# Altium schematic sheet Jetson_Orin_Nano.SchDoc
size A3; SheetNumber: 1; SheetTotal: 16
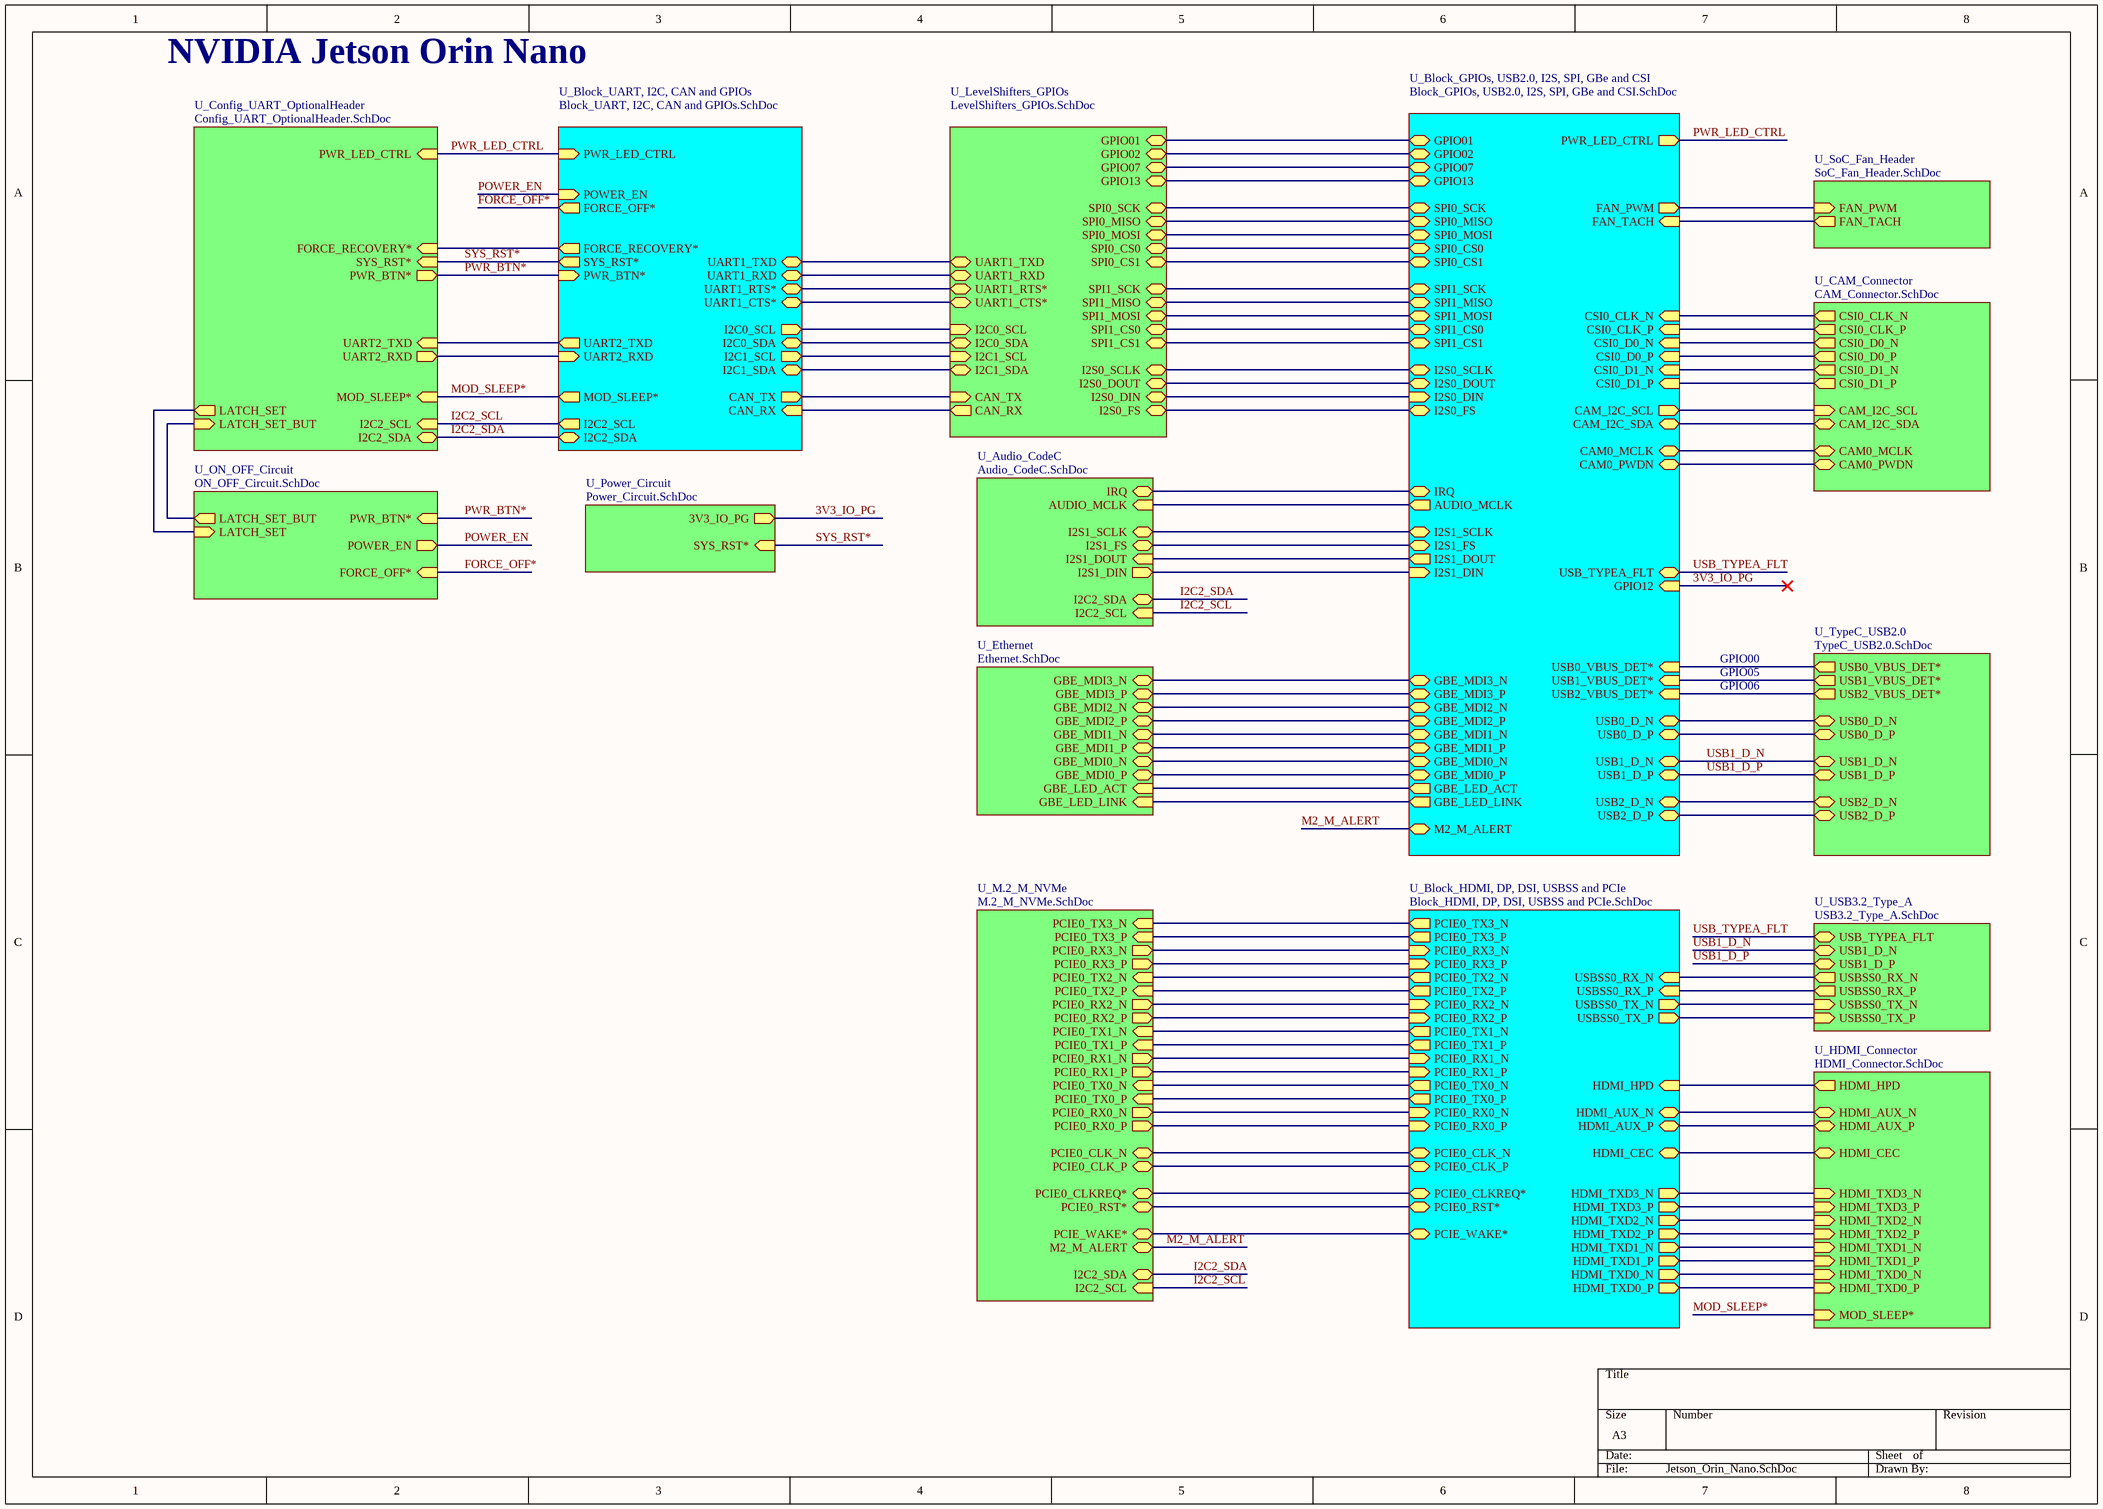
[diagram p0: Jetson_Orin_Nano.SchDoc]

## Sub-sheets
U_Audio_CodeC = Audio_CodeC.SchDoc: I2S1_SCLK (bidir), I2S1_DOUT (in), I2S1_FS (bidir), I2S1_DIN (out), AUDIO_MCLK (in), I2C2_SDA (bidir), I2C2_SCL (in), IRQ (bidir)
U_Block_GPIOs, USB2.0, I2S, SPI, GBe and CSI = Block_GPIOs, USB2.0, I2S, SPI, GBe and CSI.SchDoc: M2_M_ALERT (bidir), USB0_VBUS_DET* (in), I2S1_FS (bidir), I2S1_DOUT (out), I2S1_SCLK (bidir), I2S1_DIN (in), GBE_LED_LINK (out), GBE_LED_ACT (out), GBE_MDI3_N (bidir), GBE_MDI1_N (bidir), PWR_LED_CTRL (out), GPIO13 (bidir), AUDIO_MCLK (out), IRQ (bidir), SPI0_SCK (bidir), SPI0_MOSI (bidir), FAN_PWM (out), FAN_TACH (in), GPIO07 (bidir), SPI0_MISO (bidir), SPI1_SCK (bidir), SPI1_MOSI (bidir), SPI1_MISO (bidir), SPI1_CS0 (bidir), SPI1_CS1 (bidir), SPI0_CS0 (bidir), SPI0_CS1 (bidir), I2S0_FS (bidir), I2S0_SCLK (bidir), I2S0_DIN (in), I2S0_DOUT (bidir), GPIO02 (bidir), GPIO01 (bidir), CSI0_D0_P (in), CSI0_D0_N (in), CSI0_D1_P (in), CSI0_D1_N (in), CSI0_CLK_P (in), CSI0_CLK_N (in), CAM_I2C_SDA (bidir), CAM_I2C_SCL (out), CAM0_PWDN (bidir), CAM0_MCLK (bidir), USB_TYPEA_FLT (bidir), USB1_VBUS_DET* (in), USB2_VBUS_DET* (in), GPIO12 (in), GBE_MDI0_P (bidir), GBE_MDI0_N (bidir), GBE_MDI1_P (bidir), GBE_MDI2_P (bidir), GBE_MDI2_N (bidir), GBE_MDI3_P (bidir), USB2_D_N (bidir), USB1_D_P (bidir), USB0_D_N (bidir), USB0_D_P (bidir), USB2_D_P (bidir), USB1_D_N (bidir)
U_Block_HDMI, DP, DSI, USBSS and PCIe = Block_HDMI, DP, DSI, USBSS and PCIe.SchDoc: PCIE0_TX3_N (out), PCIE0_TX3_P (out), PCIE0_TX2_N (out), PCIE0_TX2_P (out), USBSS0_RX_N (in), USBSS0_TX_P (out), USBSS0_TX_N (out), USBSS0_RX_P (in), PCIE0_RX0_P (in), PCIE0_TX0_N (out), PCIE0_CLKREQ* (bidir), PCIE0_RST* (bidir), PCIE0_CLK_P (bidir), PCIE0_RX0_N (in), PCIE0_TX0_P (out), PCIE0_CLK_N (bidir), PCIE0_RX3_N (in), PCIE0_RX3_P (in), PCIE0_RX2_N (in), PCIE0_RX2_P (in), HDMI_CEC (bidir), PCIE_WAKE* (bidir), PCIE0_RX1_P (in), PCIE0_RX1_N (in), PCIE0_TX1_N (out), PCIE0_TX1_P (out), HDMI_TXD3_N (out), HDMI_TXD0_P (out), HDMI_TXD1_P (out), HDMI_AUX_P (bidir), HDMI_AUX_N (bidir), HDMI_TXD1_N (out), HDMI_TXD0_N (out), HDMI_TXD2_P (out), HDMI_HPD (in), HDMI_TXD3_P (out), HDMI_TXD2_N (out)
U_Block_UART, I2C, CAN and GPIOs = Block_UART, I2C, CAN and GPIOs.SchDoc: I2C1_SCL (out), I2C2_SCL (out), I2C1_SDA (bidir), I2C2_SDA (bidir), PWR_BTN* (in), PWR_LED_CTRL (in), UART1_TXD (bidir), UART1_RXD (bidir), UART2_TXD (out), UART2_RXD (in), CAN_RX (in), CAN_TX (out), MOD_SLEEP* (out), SYS_RST* (out), FORCE_RECOVERY* (out), I2C0_SCL (out), I2C0_SDA (bidir), UART1_RTS* (bidir), UART1_CTS* (bidir), POWER_EN (in), FORCE_OFF* (out)
U_CAM_Connector = CAM_Connector.SchDoc: CSI0_D0_N (out), CSI0_D0_P (out), CSI0_D1_N (out), CSI0_D1_P (out), CSI0_CLK_N (out), CSI0_CLK_P (out), CAM0_PWDN (bidir), CAM0_MCLK (bidir), CAM_I2C_SCL (in), CAM_I2C_SDA (bidir)
U_Config_UART_OptionalHeader = Config_UART_OptionalHeader.SchDoc: UART2_RXD (out), UART2_TXD (in), PWR_LED_CTRL (in), MOD_SLEEP* (in), SYS_RST* (in), FORCE_RECOVERY* (in), PWR_BTN* (out), I2C2_SCL (in), I2C2_SDA (bidir), LATCH_SET_BUT (in), LATCH_SET (out)
U_Ethernet = Ethernet.SchDoc: GBE_MDI0_P (bidir), GBE_MDI0_N (bidir), GBE_MDI1_P (bidir), GBE_MDI1_N (bidir), GBE_MDI2_P (bidir), GBE_MDI2_N (bidir), GBE_MDI3_P (bidir), GBE_MDI3_N (bidir), GBE_LED_LINK (in), GBE_LED_ACT (in)
U_HDMI_Connector = HDMI_Connector.SchDoc: HDMI_TXD0_P (in), HDMI_HPD (out), HDMI_AUX_N (bidir), HDMI_AUX_P (bidir), HDMI_CEC (bidir), HDMI_TXD3_N (in), HDMI_TXD3_P (in), HDMI_TXD2_N (in), HDMI_TXD2_P (in), HDMI_TXD1_N (in), HDMI_TXD1_P (in), HDMI_TXD0_N (in), MOD_SLEEP* (in)
U_LevelShifters_GPIOs = LevelShifters_GPIOs.SchDoc: SPI0_SCK (bidir), SPI0_MISO (bidir), SPI0_MOSI (bidir), SPI0_CS0 (bidir), SPI0_CS1 (bidir), SPI1_SCK (bidir), SPI1_MISO (bidir), SPI1_MOSI (bidir), SPI1_CS0 (bidir), SPI1_CS1 (bidir), I2C1_SDA (bidir), I2C1_SCL (in), I2C0_SCL (in), I2C0_SDA (bidir), CAN_TX (in), I2S0_SCLK (bidir), I2S0_FS (bidir), I2S0_DIN (bidir), CAN_RX (out), UART1_RXD (bidir), GPIO13 (bidir), GPIO01 (bidir), GPIO02 (bidir), GPIO07 (bidir), UART1_CTS* (bidir), UART1_RTS* (bidir), UART1_TXD (bidir), I2S0_DOUT (bidir)
U_M.2_M_NVMe = M.2_M_NVMe.SchDoc: PCIE0_TX0_P (in), PCIE0_TX0_N (in), PCIE0_RX1_P (out), PCIE0_RX1_N (out), PCIE0_TX1_P (in), PCIE0_TX1_N (in), PCIE0_RX2_P (out), PCIE0_RX2_N (out), PCIE0_TX2_P (in), PCIE0_TX2_N (in), PCIE0_RX3_P (out), PCIE0_RX3_N (out), PCIE0_TX3_P (in), PCIE0_TX3_N (in), PCIE0_RST* (bidir), PCIE0_CLKREQ* (bidir), I2C2_SCL (in), I2C2_SDA (bidir), PCIE_WAKE* (bidir), PCIE0_RX0_P (out), PCIE0_RX0_N (out), PCIE0_CLK_N (bidir), PCIE0_CLK_P (bidir), M2_M_ALERT (bidir)
U_ON_OFF_Circuit = ON_OFF_Circuit.SchDoc: PWR_BTN* (in), POWER_EN (out), FORCE_OFF* (in), LATCH_SET_BUT (out), LATCH_SET (in)
U_Power_Circuit = Power_Circuit.SchDoc: 3V3_IO_PG (out), SYS_RST* (in)
U_SoC_Fan_Header = SoC_Fan_Header.SchDoc: FAN_TACH (out), FAN_PWM (in)
U_TypeC_USB2.0 = TypeC_USB2.0.SchDoc: USB0_VBUS_DET* (out), USB0_D_P (bidir), USB0_D_N (bidir), USB1_VBUS_DET* (out), USB1_D_N (bidir), USB1_D_P (bidir), USB2_VBUS_DET* (out), USB2_D_N (bidir), USB2_D_P (bidir)
U_USB3.2_Type_A = USB3.2_Type_A.SchDoc: USB_TYPEA_FLT (bidir), USBSS0_RX_N (out), USBSS0_RX_P (out), USB1_D_N (bidir), USB1_D_P (bidir), USBSS0_TX_N (in), USBSS0_TX_P (in)

## Nets
3V3_IO_PG: sheet U_Block_GPIOs, USB2.0, I2S, SPI, GBe and CSI/GPIO12, sheet U_Power_Circuit/3V3_IO_PG
FORCE_OFF*: sheet U_Block_UART, I2C, CAN and GPIOs/FORCE_OFF*, sheet U_ON_OFF_Circuit/FORCE_OFF*
I2C2_SCL: sheet U_M.2_M_NVMe/I2C2_SCL, sheet U_Block_UART, I2C, CAN and GPIOs/I2C2_SCL, sheet U_Audio_CodeC/I2C2_SCL, sheet U_Config_UART_OptionalHeader/I2C2_SCL
I2C2_SDA: sheet U_M.2_M_NVMe/I2C2_SDA, sheet U_Block_UART, I2C, CAN and GPIOs/I2C2_SDA, sheet U_Audio_CodeC/I2C2_SDA, sheet U_Config_UART_OptionalHeader/I2C2_SDA
M2_M_ALERT: sheet U_Block_GPIOs, USB2.0, I2S, SPI, GBe and CSI/M2_M_ALERT, sheet U_M.2_M_NVMe/M2_M_ALERT
MOD_SLEEP*: sheet U_HDMI_Connector/MOD_SLEEP*, sheet U_Block_UART, I2C, CAN and GPIOs/MOD_SLEEP*, sheet U_Config_UART_OptionalHeader/MOD_SLEEP*
POWER_EN: sheet U_Block_UART, I2C, CAN and GPIOs/POWER_EN, sheet U_ON_OFF_Circuit/POWER_EN
PWR_BTN*: sheet U_Block_UART, I2C, CAN and GPIOs/PWR_BTN*, sheet U_Config_UART_OptionalHeader/PWR_BTN*, sheet U_ON_OFF_Circuit/PWR_BTN*
PWR_LED_CTRL: sheet U_Block_GPIOs, USB2.0, I2S, SPI, GBe and CSI/PWR_LED_CTRL, sheet U_Block_UART, I2C, CAN and GPIOs/PWR_LED_CTRL, sheet U_Config_UART_OptionalHeader/PWR_LED_CTRL
SYS_RST*: sheet U_Block_UART, I2C, CAN and GPIOs/SYS_RST*, sheet U_Config_UART_OptionalHeader/SYS_RST*, sheet U_Power_Circuit/SYS_RST*
USB1_D_N: sheet U_Block_GPIOs, USB2.0, I2S, SPI, GBe and CSI/USB1_D_N, sheet U_TypeC_USB2.0/USB1_D_N, sheet U_USB3.2_Type_A/USB1_D_N
USB1_D_P: sheet U_Block_GPIOs, USB2.0, I2S, SPI, GBe and CSI/USB1_D_P, sheet U_TypeC_USB2.0/USB1_D_P, sheet U_USB3.2_Type_A/USB1_D_P
USB_TYPEA_FLT: sheet U_Block_GPIOs, USB2.0, I2S, SPI, GBe and CSI/USB_TYPEA_FLT, sheet U_USB3.2_Type_A/USB_TYPEA_FLT
(unnamed): sheet U_Block_GPIOs, USB2.0, I2S, SPI, GBe and CSI/USB0_VBUS_DET*, sheet U_TypeC_USB2.0/USB0_VBUS_DET*
(unnamed): sheet U_Block_GPIOs, USB2.0, I2S, SPI, GBe and CSI/I2S1_FS, sheet U_Audio_CodeC/I2S1_FS
(unnamed): sheet U_Block_GPIOs, USB2.0, I2S, SPI, GBe and CSI/I2S1_DOUT, sheet U_Audio_CodeC/I2S1_DOUT
(unnamed): sheet U_Block_GPIOs, USB2.0, I2S, SPI, GBe and CSI/I2S1_SCLK, sheet U_Audio_CodeC/I2S1_SCLK
(unnamed): sheet U_Block_GPIOs, USB2.0, I2S, SPI, GBe and CSI/I2S1_DIN, sheet U_Audio_CodeC/I2S1_DIN
(unnamed): sheet U_Block_GPIOs, USB2.0, I2S, SPI, GBe and CSI/GBE_LED_LINK, sheet U_Ethernet/GBE_LED_LINK
(unnamed): sheet U_Block_GPIOs, USB2.0, I2S, SPI, GBe and CSI/GBE_LED_ACT, sheet U_Ethernet/GBE_LED_ACT
(unnamed): sheet U_Block_GPIOs, USB2.0, I2S, SPI, GBe and CSI/GBE_MDI3_N, sheet U_Ethernet/GBE_MDI3_N
(unnamed): sheet U_Block_GPIOs, USB2.0, I2S, SPI, GBe and CSI/GBE_MDI1_N, sheet U_Ethernet/GBE_MDI1_N
(unnamed): sheet U_Block_GPIOs, USB2.0, I2S, SPI, GBe and CSI/GPIO13, sheet U_LevelShifters_GPIOs/GPIO13
(unnamed): sheet U_Block_GPIOs, USB2.0, I2S, SPI, GBe and CSI/AUDIO_MCLK, sheet U_Audio_CodeC/AUDIO_MCLK
(unnamed): sheet U_Block_GPIOs, USB2.0, I2S, SPI, GBe and CSI/IRQ, sheet U_Audio_CodeC/IRQ
(unnamed): sheet U_Block_GPIOs, USB2.0, I2S, SPI, GBe and CSI/SPI0_SCK, sheet U_LevelShifters_GPIOs/SPI0_SCK
(unnamed): sheet U_Block_GPIOs, USB2.0, I2S, SPI, GBe and CSI/SPI0_MOSI, sheet U_LevelShifters_GPIOs/SPI0_MOSI
(unnamed): sheet U_Block_GPIOs, USB2.0, I2S, SPI, GBe and CSI/FAN_PWM, sheet U_SoC_Fan_Header/FAN_PWM
(unnamed): sheet U_Block_GPIOs, USB2.0, I2S, SPI, GBe and CSI/FAN_TACH, sheet U_SoC_Fan_Header/FAN_TACH
(unnamed): sheet U_Block_GPIOs, USB2.0, I2S, SPI, GBe and CSI/GPIO07, sheet U_LevelShifters_GPIOs/GPIO07
(unnamed): sheet U_Block_GPIOs, USB2.0, I2S, SPI, GBe and CSI/SPI0_MISO, sheet U_LevelShifters_GPIOs/SPI0_MISO
(unnamed): sheet U_Block_GPIOs, USB2.0, I2S, SPI, GBe and CSI/SPI1_SCK, sheet U_LevelShifters_GPIOs/SPI1_SCK
(unnamed): sheet U_Block_GPIOs, USB2.0, I2S, SPI, GBe and CSI/SPI1_MOSI, sheet U_LevelShifters_GPIOs/SPI1_MOSI
(unnamed): sheet U_Block_GPIOs, USB2.0, I2S, SPI, GBe and CSI/SPI1_MISO, sheet U_LevelShifters_GPIOs/SPI1_MISO
(unnamed): sheet U_Block_GPIOs, USB2.0, I2S, SPI, GBe and CSI/SPI1_CS0, sheet U_LevelShifters_GPIOs/SPI1_CS0
(unnamed): sheet U_Block_GPIOs, USB2.0, I2S, SPI, GBe and CSI/SPI1_CS1, sheet U_LevelShifters_GPIOs/SPI1_CS1
(unnamed): sheet U_Block_GPIOs, USB2.0, I2S, SPI, GBe and CSI/SPI0_CS0, sheet U_LevelShifters_GPIOs/SPI0_CS0
(unnamed): sheet U_Block_GPIOs, USB2.0, I2S, SPI, GBe and CSI/SPI0_CS1, sheet U_LevelShifters_GPIOs/SPI0_CS1
(unnamed): sheet U_Block_GPIOs, USB2.0, I2S, SPI, GBe and CSI/I2S0_FS, sheet U_LevelShifters_GPIOs/I2S0_FS
(unnamed): sheet U_Block_GPIOs, USB2.0, I2S, SPI, GBe and CSI/I2S0_SCLK, sheet U_LevelShifters_GPIOs/I2S0_SCLK
(unnamed): sheet U_Block_GPIOs, USB2.0, I2S, SPI, GBe and CSI/I2S0_DIN, sheet U_LevelShifters_GPIOs/I2S0_DIN
(unnamed): sheet U_Block_GPIOs, USB2.0, I2S, SPI, GBe and CSI/I2S0_DOUT, sheet U_LevelShifters_GPIOs/I2S0_DOUT
(unnamed): sheet U_Block_GPIOs, USB2.0, I2S, SPI, GBe and CSI/GPIO02, sheet U_LevelShifters_GPIOs/GPIO02
(unnamed): sheet U_Block_GPIOs, USB2.0, I2S, SPI, GBe and CSI/GPIO01, sheet U_LevelShifters_GPIOs/GPIO01
(unnamed): sheet U_Block_GPIOs, USB2.0, I2S, SPI, GBe and CSI/CSI0_D0_P, sheet U_CAM_Connector/CSI0_D0_P
(unnamed): sheet U_Block_GPIOs, USB2.0, I2S, SPI, GBe and CSI/CSI0_D0_N, sheet U_CAM_Connector/CSI0_D0_N
(unnamed): sheet U_Block_GPIOs, USB2.0, I2S, SPI, GBe and CSI/CSI0_D1_P, sheet U_CAM_Connector/CSI0_D1_P
(unnamed): sheet U_Block_GPIOs, USB2.0, I2S, SPI, GBe and CSI/CSI0_D1_N, sheet U_CAM_Connector/CSI0_D1_N
(unnamed): sheet U_Block_GPIOs, USB2.0, I2S, SPI, GBe and CSI/CSI0_CLK_P, sheet U_CAM_Connector/CSI0_CLK_P
(unnamed): sheet U_Block_GPIOs, USB2.0, I2S, SPI, GBe and CSI/CSI0_CLK_N, sheet U_CAM_Connector/CSI0_CLK_N
(unnamed): sheet U_Block_GPIOs, USB2.0, I2S, SPI, GBe and CSI/CAM_I2C_SDA, sheet U_CAM_Connector/CAM_I2C_SDA
(unnamed): sheet U_Block_GPIOs, USB2.0, I2S, SPI, GBe and CSI/CAM_I2C_SCL, sheet U_CAM_Connector/CAM_I2C_SCL
(unnamed): sheet U_Block_GPIOs, USB2.0, I2S, SPI, GBe and CSI/CAM0_PWDN, sheet U_CAM_Connector/CAM0_PWDN
(unnamed): sheet U_Block_GPIOs, USB2.0, I2S, SPI, GBe and CSI/CAM0_MCLK, sheet U_CAM_Connector/CAM0_MCLK
(unnamed): sheet U_Block_GPIOs, USB2.0, I2S, SPI, GBe and CSI/USB1_VBUS_DET*, sheet U_TypeC_USB2.0/USB1_VBUS_DET*
(unnamed): sheet U_Block_GPIOs, USB2.0, I2S, SPI, GBe and CSI/USB2_VBUS_DET*, sheet U_TypeC_USB2.0/USB2_VBUS_DET*
(unnamed): sheet U_Block_GPIOs, USB2.0, I2S, SPI, GBe and CSI/GBE_MDI0_P, sheet U_Ethernet/GBE_MDI0_P
(unnamed): sheet U_Block_GPIOs, USB2.0, I2S, SPI, GBe and CSI/GBE_MDI0_N, sheet U_Ethernet/GBE_MDI0_N
(unnamed): sheet U_Block_GPIOs, USB2.0, I2S, SPI, GBe and CSI/GBE_MDI1_P, sheet U_Ethernet/GBE_MDI1_P
(unnamed): sheet U_Block_GPIOs, USB2.0, I2S, SPI, GBe and CSI/GBE_MDI2_P, sheet U_Ethernet/GBE_MDI2_P
(unnamed): sheet U_Block_GPIOs, USB2.0, I2S, SPI, GBe and CSI/GBE_MDI2_N, sheet U_Ethernet/GBE_MDI2_N
(unnamed): sheet U_Block_GPIOs, USB2.0, I2S, SPI, GBe and CSI/GBE_MDI3_P, sheet U_Ethernet/GBE_MDI3_P
(unnamed): sheet U_Block_GPIOs, USB2.0, I2S, SPI, GBe and CSI/USB2_D_N, sheet U_TypeC_USB2.0/USB2_D_N
(unnamed): sheet U_Block_GPIOs, USB2.0, I2S, SPI, GBe and CSI/USB0_D_N, sheet U_TypeC_USB2.0/USB0_D_N
(unnamed): sheet U_Block_GPIOs, USB2.0, I2S, SPI, GBe and CSI/USB0_D_P, sheet U_TypeC_USB2.0/USB0_D_P
(unnamed): sheet U_Block_GPIOs, USB2.0, I2S, SPI, GBe and CSI/USB2_D_P, sheet U_TypeC_USB2.0/USB2_D_P
(unnamed): sheet U_Block_HDMI, DP, DSI, USBSS and PCIe/PCIE0_TX3_N, sheet U_M.2_M_NVMe/PCIE0_TX3_N
(unnamed): sheet U_Block_HDMI, DP, DSI, USBSS and PCIe/PCIE0_TX3_P, sheet U_M.2_M_NVMe/PCIE0_TX3_P
(unnamed): sheet U_Block_HDMI, DP, DSI, USBSS and PCIe/PCIE0_TX2_N, sheet U_M.2_M_NVMe/PCIE0_TX2_N
(unnamed): sheet U_Block_HDMI, DP, DSI, USBSS and PCIe/PCIE0_TX2_P, sheet U_M.2_M_NVMe/PCIE0_TX2_P
(unnamed): sheet U_Block_HDMI, DP, DSI, USBSS and PCIe/USBSS0_RX_N, sheet U_USB3.2_Type_A/USBSS0_RX_N
(unnamed): sheet U_Block_HDMI, DP, DSI, USBSS and PCIe/USBSS0_TX_P, sheet U_USB3.2_Type_A/USBSS0_TX_P
(unnamed): sheet U_Block_HDMI, DP, DSI, USBSS and PCIe/USBSS0_TX_N, sheet U_USB3.2_Type_A/USBSS0_TX_N
(unnamed): sheet U_Block_HDMI, DP, DSI, USBSS and PCIe/USBSS0_RX_P, sheet U_USB3.2_Type_A/USBSS0_RX_P
(unnamed): sheet U_Block_HDMI, DP, DSI, USBSS and PCIe/PCIE0_RX0_P, sheet U_M.2_M_NVMe/PCIE0_RX0_P
(unnamed): sheet U_Block_HDMI, DP, DSI, USBSS and PCIe/PCIE0_TX0_N, sheet U_M.2_M_NVMe/PCIE0_TX0_N
(unnamed): sheet U_Block_HDMI, DP, DSI, USBSS and PCIe/PCIE0_CLKREQ*, sheet U_M.2_M_NVMe/PCIE0_CLKREQ*
(unnamed): sheet U_Block_HDMI, DP, DSI, USBSS and PCIe/PCIE0_RST*, sheet U_M.2_M_NVMe/PCIE0_RST*
(unnamed): sheet U_Block_HDMI, DP, DSI, USBSS and PCIe/PCIE0_CLK_P, sheet U_M.2_M_NVMe/PCIE0_CLK_P
(unnamed): sheet U_Block_HDMI, DP, DSI, USBSS and PCIe/PCIE0_RX0_N, sheet U_M.2_M_NVMe/PCIE0_RX0_N
(unnamed): sheet U_Block_HDMI, DP, DSI, USBSS and PCIe/PCIE0_TX0_P, sheet U_M.2_M_NVMe/PCIE0_TX0_P
(unnamed): sheet U_Block_HDMI, DP, DSI, USBSS and PCIe/PCIE0_CLK_N, sheet U_M.2_M_NVMe/PCIE0_CLK_N
(unnamed): sheet U_Block_HDMI, DP, DSI, USBSS and PCIe/PCIE0_RX3_N, sheet U_M.2_M_NVMe/PCIE0_RX3_N
(unnamed): sheet U_Block_HDMI, DP, DSI, USBSS and PCIe/PCIE0_RX3_P, sheet U_M.2_M_NVMe/PCIE0_RX3_P
(unnamed): sheet U_Block_HDMI, DP, DSI, USBSS and PCIe/PCIE0_RX2_N, sheet U_M.2_M_NVMe/PCIE0_RX2_N
(unnamed): sheet U_Block_HDMI, DP, DSI, USBSS and PCIe/PCIE0_RX2_P, sheet U_M.2_M_NVMe/PCIE0_RX2_P
(unnamed): sheet U_Block_HDMI, DP, DSI, USBSS and PCIe/HDMI_CEC, sheet U_HDMI_Connector/HDMI_CEC
(unnamed): sheet U_Block_HDMI, DP, DSI, USBSS and PCIe/PCIE_WAKE*, sheet U_M.2_M_NVMe/PCIE_WAKE*
(unnamed): sheet U_Block_HDMI, DP, DSI, USBSS and PCIe/PCIE0_RX1_P, sheet U_M.2_M_NVMe/PCIE0_RX1_P
(unnamed): sheet U_Block_HDMI, DP, DSI, USBSS and PCIe/PCIE0_RX1_N, sheet U_M.2_M_NVMe/PCIE0_RX1_N
(unnamed): sheet U_Block_HDMI, DP, DSI, USBSS and PCIe/PCIE0_TX1_N, sheet U_M.2_M_NVMe/PCIE0_TX1_N
(unnamed): sheet U_Block_HDMI, DP, DSI, USBSS and PCIe/PCIE0_TX1_P, sheet U_M.2_M_NVMe/PCIE0_TX1_P
(unnamed): sheet U_Block_HDMI, DP, DSI, USBSS and PCIe/HDMI_TXD3_N, sheet U_HDMI_Connector/HDMI_TXD3_N
(unnamed): sheet U_Block_HDMI, DP, DSI, USBSS and PCIe/HDMI_TXD0_P, sheet U_HDMI_Connector/HDMI_TXD0_P
(unnamed): sheet U_Block_HDMI, DP, DSI, USBSS and PCIe/HDMI_TXD1_P, sheet U_HDMI_Connector/HDMI_TXD1_P
(unnamed): sheet U_Block_HDMI, DP, DSI, USBSS and PCIe/HDMI_AUX_P, sheet U_HDMI_Connector/HDMI_AUX_P
(unnamed): sheet U_Block_HDMI, DP, DSI, USBSS and PCIe/HDMI_AUX_N, sheet U_HDMI_Connector/HDMI_AUX_N
(unnamed): sheet U_Block_HDMI, DP, DSI, USBSS and PCIe/HDMI_TXD1_N, sheet U_HDMI_Connector/HDMI_TXD1_N
(unnamed): sheet U_Block_HDMI, DP, DSI, USBSS and PCIe/HDMI_TXD0_N, sheet U_HDMI_Connector/HDMI_TXD0_N
(unnamed): sheet U_Block_HDMI, DP, DSI, USBSS and PCIe/HDMI_TXD2_P, sheet U_HDMI_Connector/HDMI_TXD2_P
(unnamed): sheet U_Block_HDMI, DP, DSI, USBSS and PCIe/HDMI_HPD, sheet U_HDMI_Connector/HDMI_HPD
(unnamed): sheet U_Block_HDMI, DP, DSI, USBSS and PCIe/HDMI_TXD3_P, sheet U_HDMI_Connector/HDMI_TXD3_P
(unnamed): sheet U_Block_HDMI, DP, DSI, USBSS and PCIe/HDMI_TXD2_N, sheet U_HDMI_Connector/HDMI_TXD2_N
(unnamed): sheet U_Block_UART, I2C, CAN and GPIOs/I2C1_SCL, sheet U_LevelShifters_GPIOs/I2C1_SCL
(unnamed): sheet U_Block_UART, I2C, CAN and GPIOs/I2C1_SDA, sheet U_LevelShifters_GPIOs/I2C1_SDA
(unnamed): sheet U_Block_UART, I2C, CAN and GPIOs/UART1_TXD, sheet U_LevelShifters_GPIOs/UART1_TXD
(unnamed): sheet U_Block_UART, I2C, CAN and GPIOs/UART1_RXD, sheet U_LevelShifters_GPIOs/UART1_RXD
(unnamed): sheet U_Block_UART, I2C, CAN and GPIOs/UART2_TXD, sheet U_Config_UART_OptionalHeader/UART2_TXD
(unnamed): sheet U_Block_UART, I2C, CAN and GPIOs/UART2_RXD, sheet U_Config_UART_OptionalHeader/UART2_RXD
(unnamed): sheet U_Block_UART, I2C, CAN and GPIOs/CAN_RX, sheet U_LevelShifters_GPIOs/CAN_RX
(unnamed): sheet U_Block_UART, I2C, CAN and GPIOs/CAN_TX, sheet U_LevelShifters_GPIOs/CAN_TX
(unnamed): sheet U_Block_UART, I2C, CAN and GPIOs/FORCE_RECOVERY*, sheet U_Config_UART_OptionalHeader/FORCE_RECOVERY*
(unnamed): sheet U_Block_UART, I2C, CAN and GPIOs/I2C0_SCL, sheet U_LevelShifters_GPIOs/I2C0_SCL
(unnamed): sheet U_Block_UART, I2C, CAN and GPIOs/I2C0_SDA, sheet U_LevelShifters_GPIOs/I2C0_SDA
(unnamed): sheet U_Block_UART, I2C, CAN and GPIOs/UART1_RTS*, sheet U_LevelShifters_GPIOs/UART1_RTS*
(unnamed): sheet U_Block_UART, I2C, CAN and GPIOs/UART1_CTS*, sheet U_LevelShifters_GPIOs/UART1_CTS*
(unnamed): sheet U_Config_UART_OptionalHeader/LATCH_SET_BUT, sheet U_ON_OFF_Circuit/LATCH_SET_BUT
(unnamed): sheet U_Config_UART_OptionalHeader/LATCH_SET, sheet U_ON_OFF_Circuit/LATCH_SET

## Notes on the sheet
- NVIDIA Jetson Orin Nano
- GPIO00
- GPIO05
- GPIO06